# EAGLE design display_board (EAGLE 9.6.1)
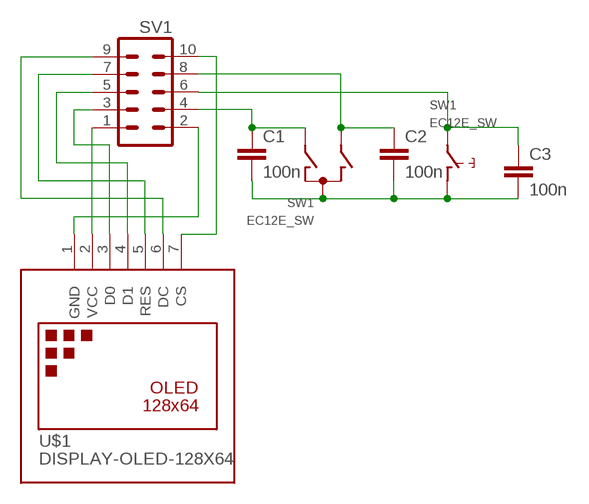
[diagram p0: schematic, sheet 1]

## Parts
C1  100n  C-EUC1206  [C1206]
C2  100n  C-EUC1206  [C1206]
C3  100n  C-EUC1206  [C1206]
SV1  MA05-2  [MA05-2]
SW1  EC12E_SW  [ALPS_EC12E_SW]
U$1  DISPLAY-OLED-128X64  [DISPLAY-OLED-128X64]

## Nets
N$1: SV1.1 U$1.2(VCC)
N$2: SV1.3 U$1.3(D0)
N$3: SV1.5 U$1.4(D1)
N$4: SV1.7 U$1.5(RES)
N$5: SV1.9 U$1.6(DC)
N$6: SV1.2 U$1.1(GND)
N$7: C1.1 SV1.4 SW1.A
N$8: C1.2 C2.2 C3.2 SW1.C SW1.D
N$9: C2.1 SV1.8 SW1.B
N$10: C3.1 SV1.6 SW1.E
N$11: SV1.10 U$1.7(CS)
Unconnected: SW1.GND1(G) SW1.GND2(G)

## Library data of the parts
C1-C3 = rcl:C-EU: CAPACITOR, European symbol; SPICEPREFIX: C
SV1 = con-lstb:MA05-2: PIN HEADER; OC_FARNELL: unknown; OC_NEWARK: unknown
SW1 = switch-alps:EC12E_SW: ALPS rotary Encoder EC12E series with switch; MPN: EC12E2424407; OC_FARNELL: 1520813; OC_NEWARK: 74M1068
U$1 = diy-modules:DISPLAY-OLED-128X64: 128x64 Dot Matrix OLED Module based on SSD1306 chip Variant with SPI interface More details available here: http://www.instructables.com/id/How-to-use-OLED-display-arduino-module/ SSD1306 datasheet: https://cdn-shop.adafruit.com/datasheets/SSD1306.pdf Click here to find device on ebay.com <http://www.ebay.com/sch/oled+display+128x64> Note: There are two variants: I2C and SPI. Search for the proper version.

## Board
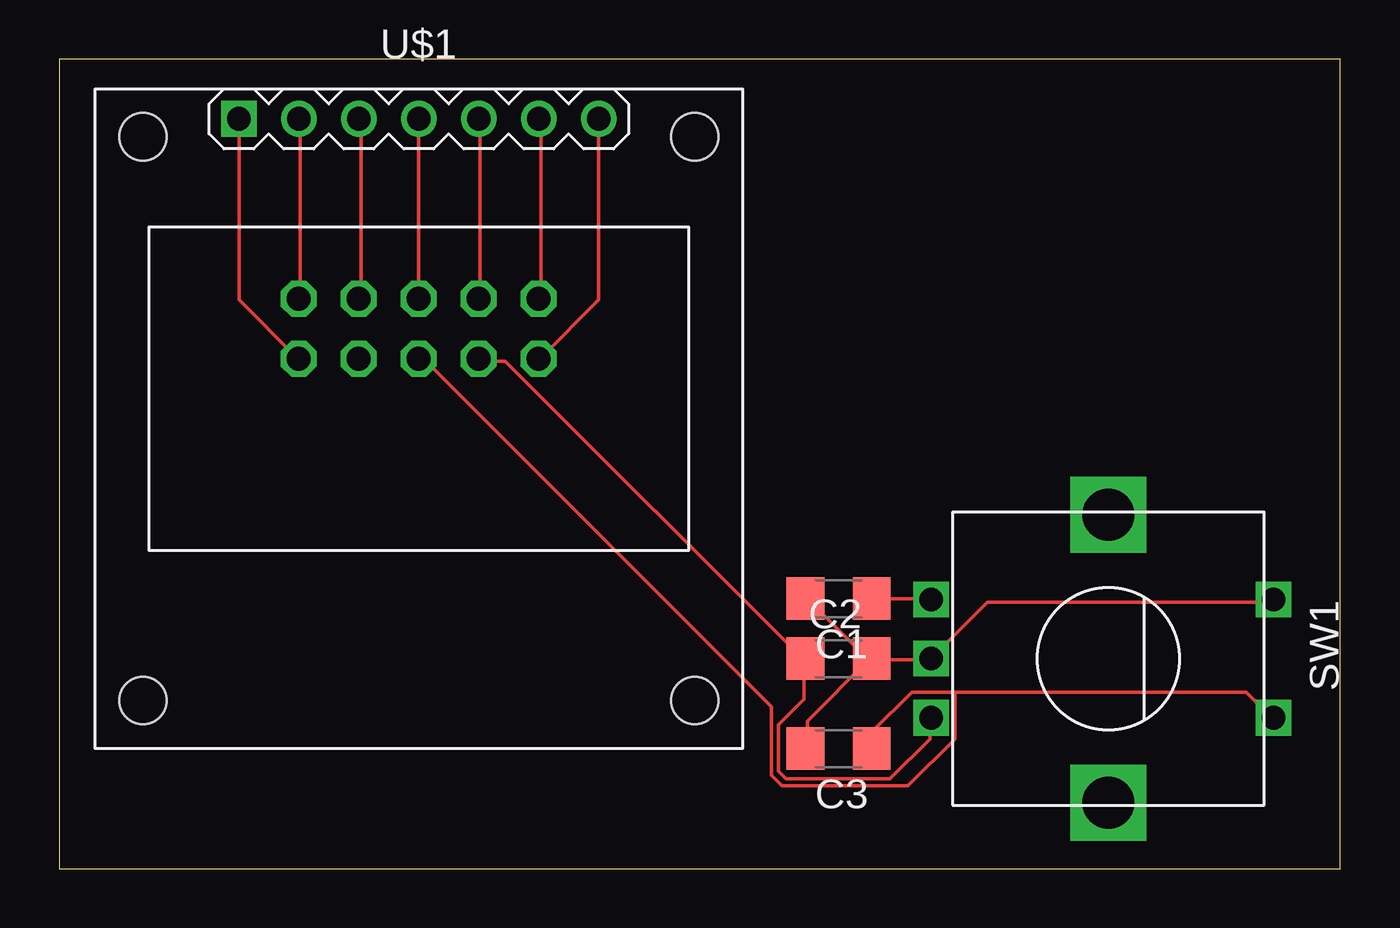
[diagram p1: board, top side]
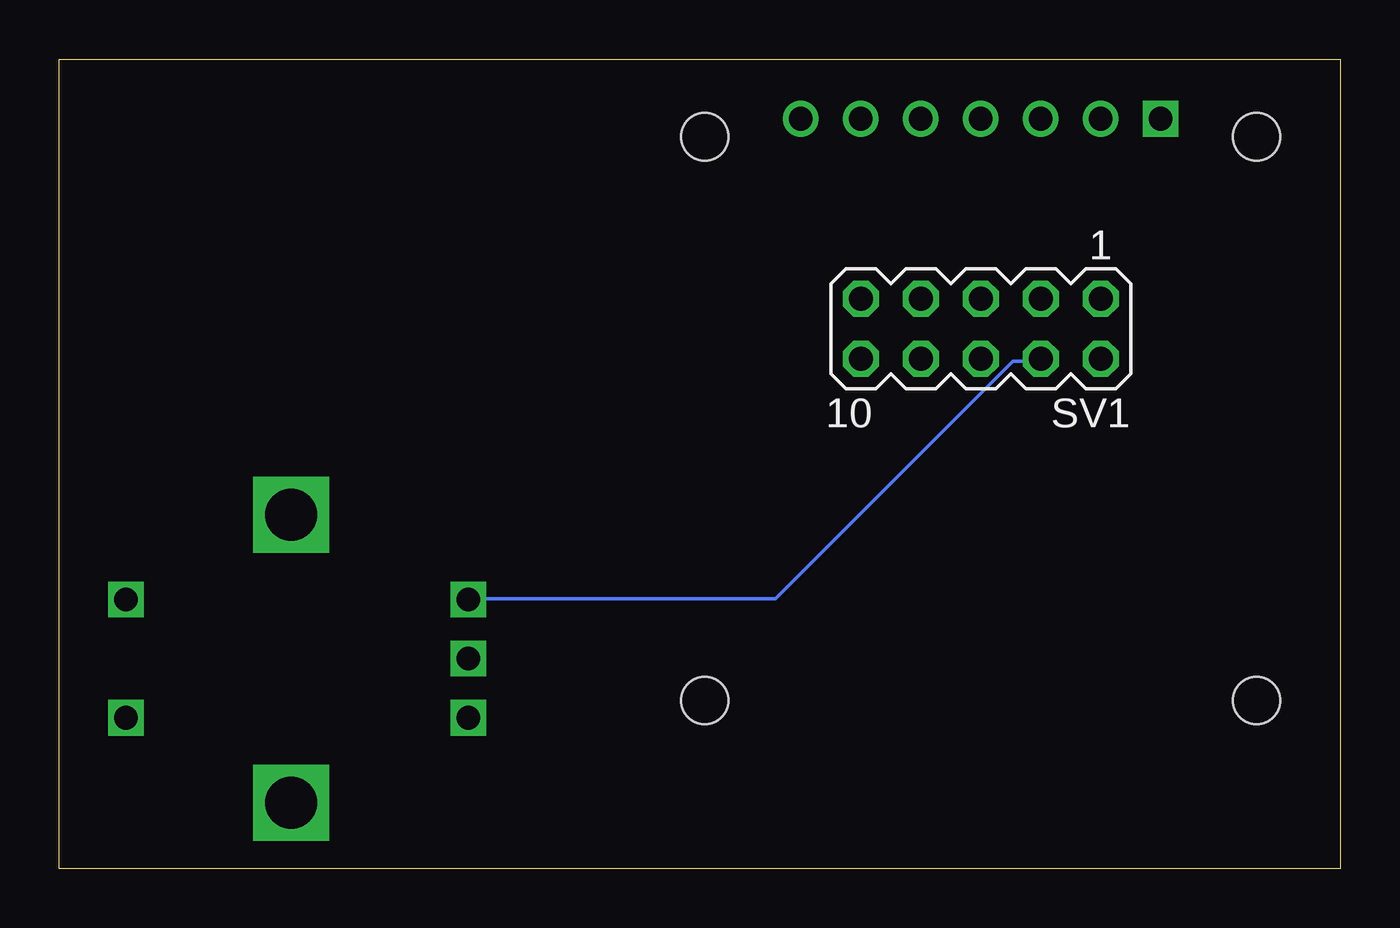
[diagram p2: board, bottom side, seen from below]

Size 54.28 x 34.28 mm. Coordinates in mm from the lower left corner, seen from the top.
Outline: 0,0 54.28,0 54.28,34.28 0,34.28 0,0
Copper layers (1*16): Top 0.035mm / dielectric 1.5mm / Bottom 0.035mm
Design rules "default": minimum track width 6mil, minimum drill 0.35mm, track to track 6mil, track to pad 6mil, pad to pad 6mil, via to via 6mil, smd to smd 6mil, copper to edge 40mil, drill to drill 6mil, minimum pad ring 10mil, minimum via ring 8mil, stop-mask expansion 4mil, vias tented up to drill 0mil, thermal gap 10mil

### Footprints (pad centres in the part's own frame; a part is rotated, then mirrored left to right if it is on the bottom)
C1206 = smd 1.6 x 1.8: 1 -1.4,0; 2 1.4,0
MA05-2 = drill 1.016 octagon: 1 -5.08,-1.27; 2 -5.08,1.27; 3 -2.54,-1.27; 4 -2.54,1.27; 5 0,-1.27; 6 0,1.27; 7 2.54,-1.27; 8 2.54,1.27; 9 5.08,-1.27; 10 5.08,1.27
ALPS_EC12E_SW = drill 1 square: A -2.5,-7.5; B 2.5,-7.5; C 0,-7.5; D -2.5,7; E 2.5,7 | drill 2.2 square: GND1 -6.1,0; GND2 6.1,0
DISPLAY-OLED-128X64 = drill 1 square: 1 -7.62,12.7 | drill 1: 2 -5.08,12.7; 3 -2.54,12.7; 4 0,12.7; 5 2.54,12.7; 6 5.08,12.7; 7 7.62,12.7 | hole 2: -11.684,11.938; 11.684,11.938; 11.684,-11.938; -11.684,-11.938

### Placement (x,y rotation side)
C1  33.02,11.43 180 top
C2  33.02,8.89 0 top
C3  33.02,5.08 180 top
SV1  15.24,22.86 180 bottom
SW1  44.45,8.89 270 top
U$1  15.24,19.05 0 top

### Tracks (layer width: path | path; a pad name or v marks a point on that pad's centre or on a via)
N$1
  Top 0.152: U$1.2 10.21,31.7 10.21,24.23 SV1.1
N$2
  Top 0.152: U$1.3 12.8,31.7 12.8,24.23 SV1.3
N$3
  Top 0.152: SV1.5 U$1.4
N$4
  Top 0.152: U$1.5 17.83,31.7 17.83,24.23 SV1.7
N$5
  Top 0.152: U$1.6 20.42,31.7 20.42,24.23 SV1.9
N$6
  Top 0.152: U$1.1 7.62,24.08 10.06,21.64 SV1.2
N$7
  Top 0.152: C1.1 36.88,11.43 SW1.A
  Bottom 0.152: SV1.4 12.8,21.49 13.87,21.49 23.93,11.43 36.88,11.43 SW1.A
N$8
  Top 0.152: 34.29,8.84 31.7,6.25 31.7,5.18 C3.2 | 34.29,8.84 31.7,11.43 C1.2 | 34.29,8.84 C2.2 34.44,8.84 36.88,8.84 SW1.C 37.03,8.99 39.32,11.28 51.36,11.28 SW1.D
N$9
  Top 0.152: 31.55,8.84 31.55,7.16 30.48,6.1 30.48,4.12 30.79,3.81 35.2,3.81 36.88,5.49 36.88,6.25 SW1.B | 31.55,8.84 18.9,21.49 17.83,21.49 SV1.8 | 31.55,8.84 C2.1
N$10
  Top 0.152: 37.95,7.47 50.29,7.47 51.36,6.4 SW1.E | 37.95,7.47 36.12,7.47 34.44,5.79 34.44,5.18 C3.1 | 37.95,7.47 37.95,5.49 35.97,3.51 30.63,3.51 30.18,3.96 30.18,6.86 15.54,21.49 15.24,21.49 SV1.6
N$11
  Top 0.152: U$1.7 22.86,24.08 20.42,21.64 SV1.10